# EAGLE schematic v0 (EAGLE 9.6.2)
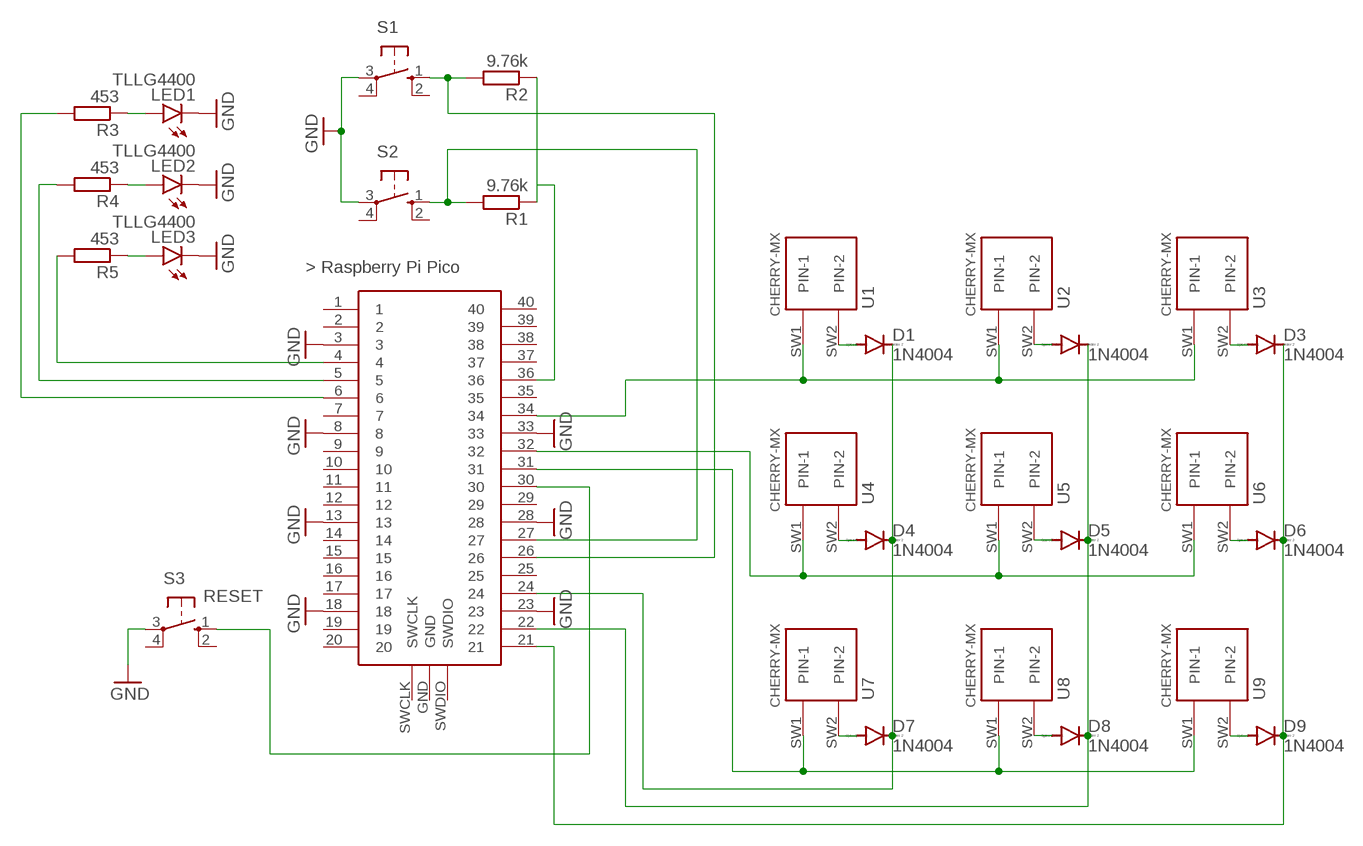
[diagram p0: schematic, sheet 1]

## Parts
D1  1N4004  [DO41-10]
D2  1N4004  [DO41-10]
D3  1N4004  [DO41-10]
D4  1N4004  [DO41-10]
D5  1N4004  [DO41-10]
D6  1N4004  [DO41-10]
D7  1N4004  [DO41-10]
D8  1N4004  [DO41-10]
D9  1N4004  [DO41-10]
LED1  TLLG4400  [LED3MM]
LED2  TLLG4400  [LED3MM]
LED3  TLLG4400  [LED3MM]
R1  9.76k  R-EU_VMTA55  [VMTA55]
R2  9.76k  R-EU_VMTA55  [VMTA55]
R3  453  R-EU_VMTA55  [VMTA55]
R4  453  R-EU_VMTA55  [VMTA55]
R5  453  R-EU_VMTA55  [VMTA55]
S1  10-XX  [B3F-10XX]
S2  10-XX  [B3F-10XX]
S3  RESET  10-XX  [B3F-10XX]
U1  CHERRY-MX  [CHERRY-MX]
U2  CHERRY-MX  [CHERRY-MX]
U3  CHERRY-MX  [CHERRY-MX]
U4  CHERRY-MX  [CHERRY-MX]
U5  CHERRY-MX  [CHERRY-MX]
U6  CHERRY-MX  [CHERRY-MX]
U7  CHERRY-MX  [CHERRY-MX]
U8  CHERRY-MX  [CHERRY-MX]
U9  CHERRY-MX  [CHERRY-MX]
U$1  RASPBERRY-PI-PICO_TH  [FT_RASPBERRY-PI-PICO_TH]

## Nets
GND: LED1.K(C) LED2.K(C) LED3.K(C) S1.3(P) S2.3(P) S3.3(P) U$1.3 U$1.8 U$1.13 U$1.18 U$1.23 U$1.28 U$1.33
N$1: LED2.A R4.1
N$2: LED1.A R3.1
N$3: LED3.A R5.1
N$4: R1.2 S2.1(S) U$1.27
N$5: R5.2 U$1.4
N$6: R4.2 U$1.5
N$7: R3.2 U$1.6
N$9: R2.2 S1.1(S) U$1.26
N$12: R1.1 R2.1 U$1.36
N$13: S3.1(S) U$1.30
N$15: D1.C D4.C D7.C U$1.24
N$16: D2.C D5.C D8.C U$1.22
N$17: D3.C D6.C D9.C U$1.21
N$18: D6.A U6.SW2(PIN-2)
N$19: D3.A U3.SW2(PIN-2)
N$20: D9.A U9.SW2(PIN-2)
N$21: D8.A U8.SW2(PIN-2)
N$22: D5.A U5.SW2(PIN-2)
N$23: D2.A U2.SW2(PIN-2)
N$24: D1.A U1.SW2(PIN-2)
N$25: D4.A U4.SW2(PIN-2)
N$26: D7.A U7.SW2(PIN-2)
N$27: U1.SW1(PIN-1) U2.SW1(PIN-1) U3.SW1(PIN-1) U$1.34
N$28: U4.SW1(PIN-1) U5.SW1(PIN-1) U6.SW1(PIN-1) U$1.32
N$29: U7.SW1(PIN-1) U8.SW1(PIN-1) U9.SW1(PIN-1) U$1.31
Unconnected: S1.2(S1) S1.4(P1) S2.2(S1) S2.4(P1) S3.2(S1) S3.4(P1) U$1.1 U$1.2 U$1.7 U$1.9 U$1.10 U$1.11 U$1.12 U$1.14 U$1.15 U$1.16 U$1.17 U$1.19 U$1.20 U$1.25 U$1.29 U$1.35 U$1.37 U$1.38 U$1.39 U$1.40 U$1.GND U$1.SWCLK U$1.SWDIO

## Library data of the parts
D1-D9 = diode:1N4004: DIODE general purpose rectifier, 1 A
LED1-LED3 = led:TLLG4400: Low Current (2mA) LED 3 mm Tinted Diffused Package color GREEN Source: Data sheet <http://www.farnell.com/datasheets/391098.pdf>; MF: VISHAY SEMICONDUCTOR; OC_FARNELL: 1612435
R1-R5 = rcl:R-EU_: RESISTOR, European symbol; SPICEPREFIX: R
S1-S3 = switch-omron:10-XX: OMRON SWITCH; MPN: B3F-1000; OC_FARNELL: 176432; OC_NEWARK: 36M3542
U1-U9 = cherrymx:CHERRY-MX: Cherry MX series keyswitch
U$1 = pipico:RASPBERRY-PI-PICO_TH: Raspberry Pi Pico microcontroller board for through-hole mounting.

## Net classes
0 default: width 0.305 mm